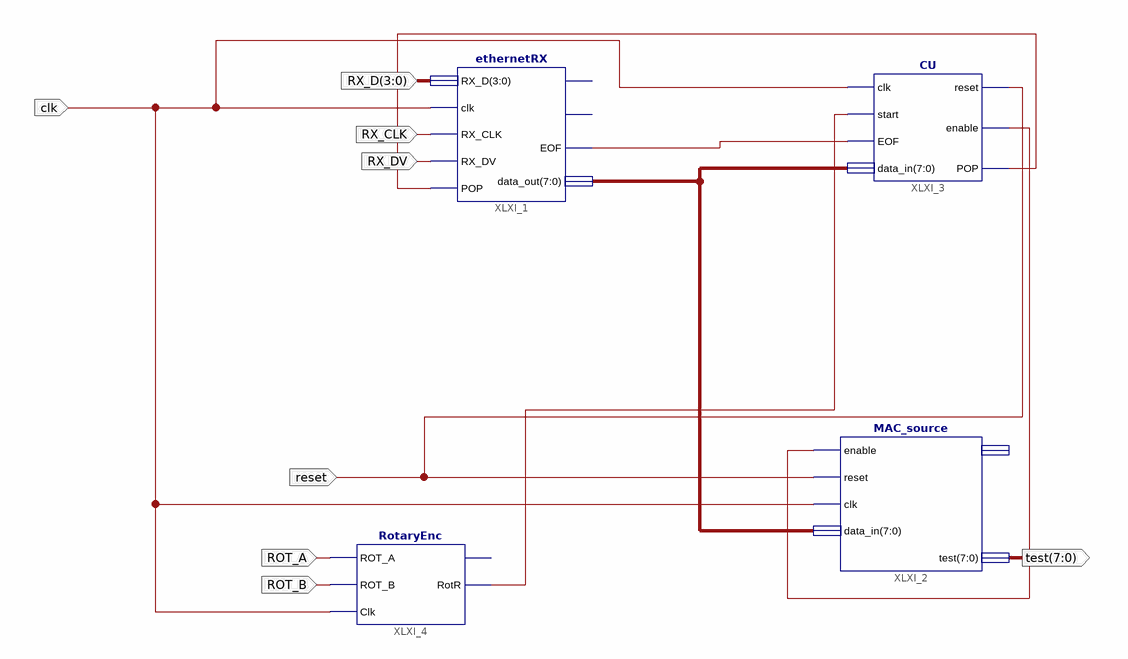
[diagram p0: schematic sheet 1]
// Xilinx ISE schematic stupid.sch (spartan3e) as structural Verilog: 4 symbols, 8 ports
module stupid (
  input  clk,
  input  reset,
  input  [3:0] RX_D,
  input  RX_CLK,
  input  RX_DV,
  input  ROT_A,
  input  ROT_B,
  output [7:0] test
);

  wire start, XLXN_3, XLXN_4, XLXN_7;
  wire [7:0] XLXN_5;

  ethernetRX XLXI_1 (
    .RX_D(RX_D), .clk(clk), .RX_CLK(RX_CLK), .RX_DV(RX_DV), .POP(XLXN_3), .EOF(XLXN_7), .data_out(XLXN_5));  // open: empty, full
  MAC_source XLXI_2 (.enable(XLXN_4), .reset(reset), .clk(clk), .data_in(XLXN_5), .test(test));  // open: source_MAC
  CU XLXI_3 (.clk(clk), .start(start), .EOF(XLXN_7), .reset(reset), .data_in(XLXN_5), .enable(XLXN_4), .POP(XLXN_3));
  RotaryEnc XLXI_4 (.ROT_A(ROT_A), .ROT_B(ROT_B), .RotR(start), .Clk(clk));  // open: RotL
endmodule
